# Altium project STM32_F4VX_M.PrjPcb
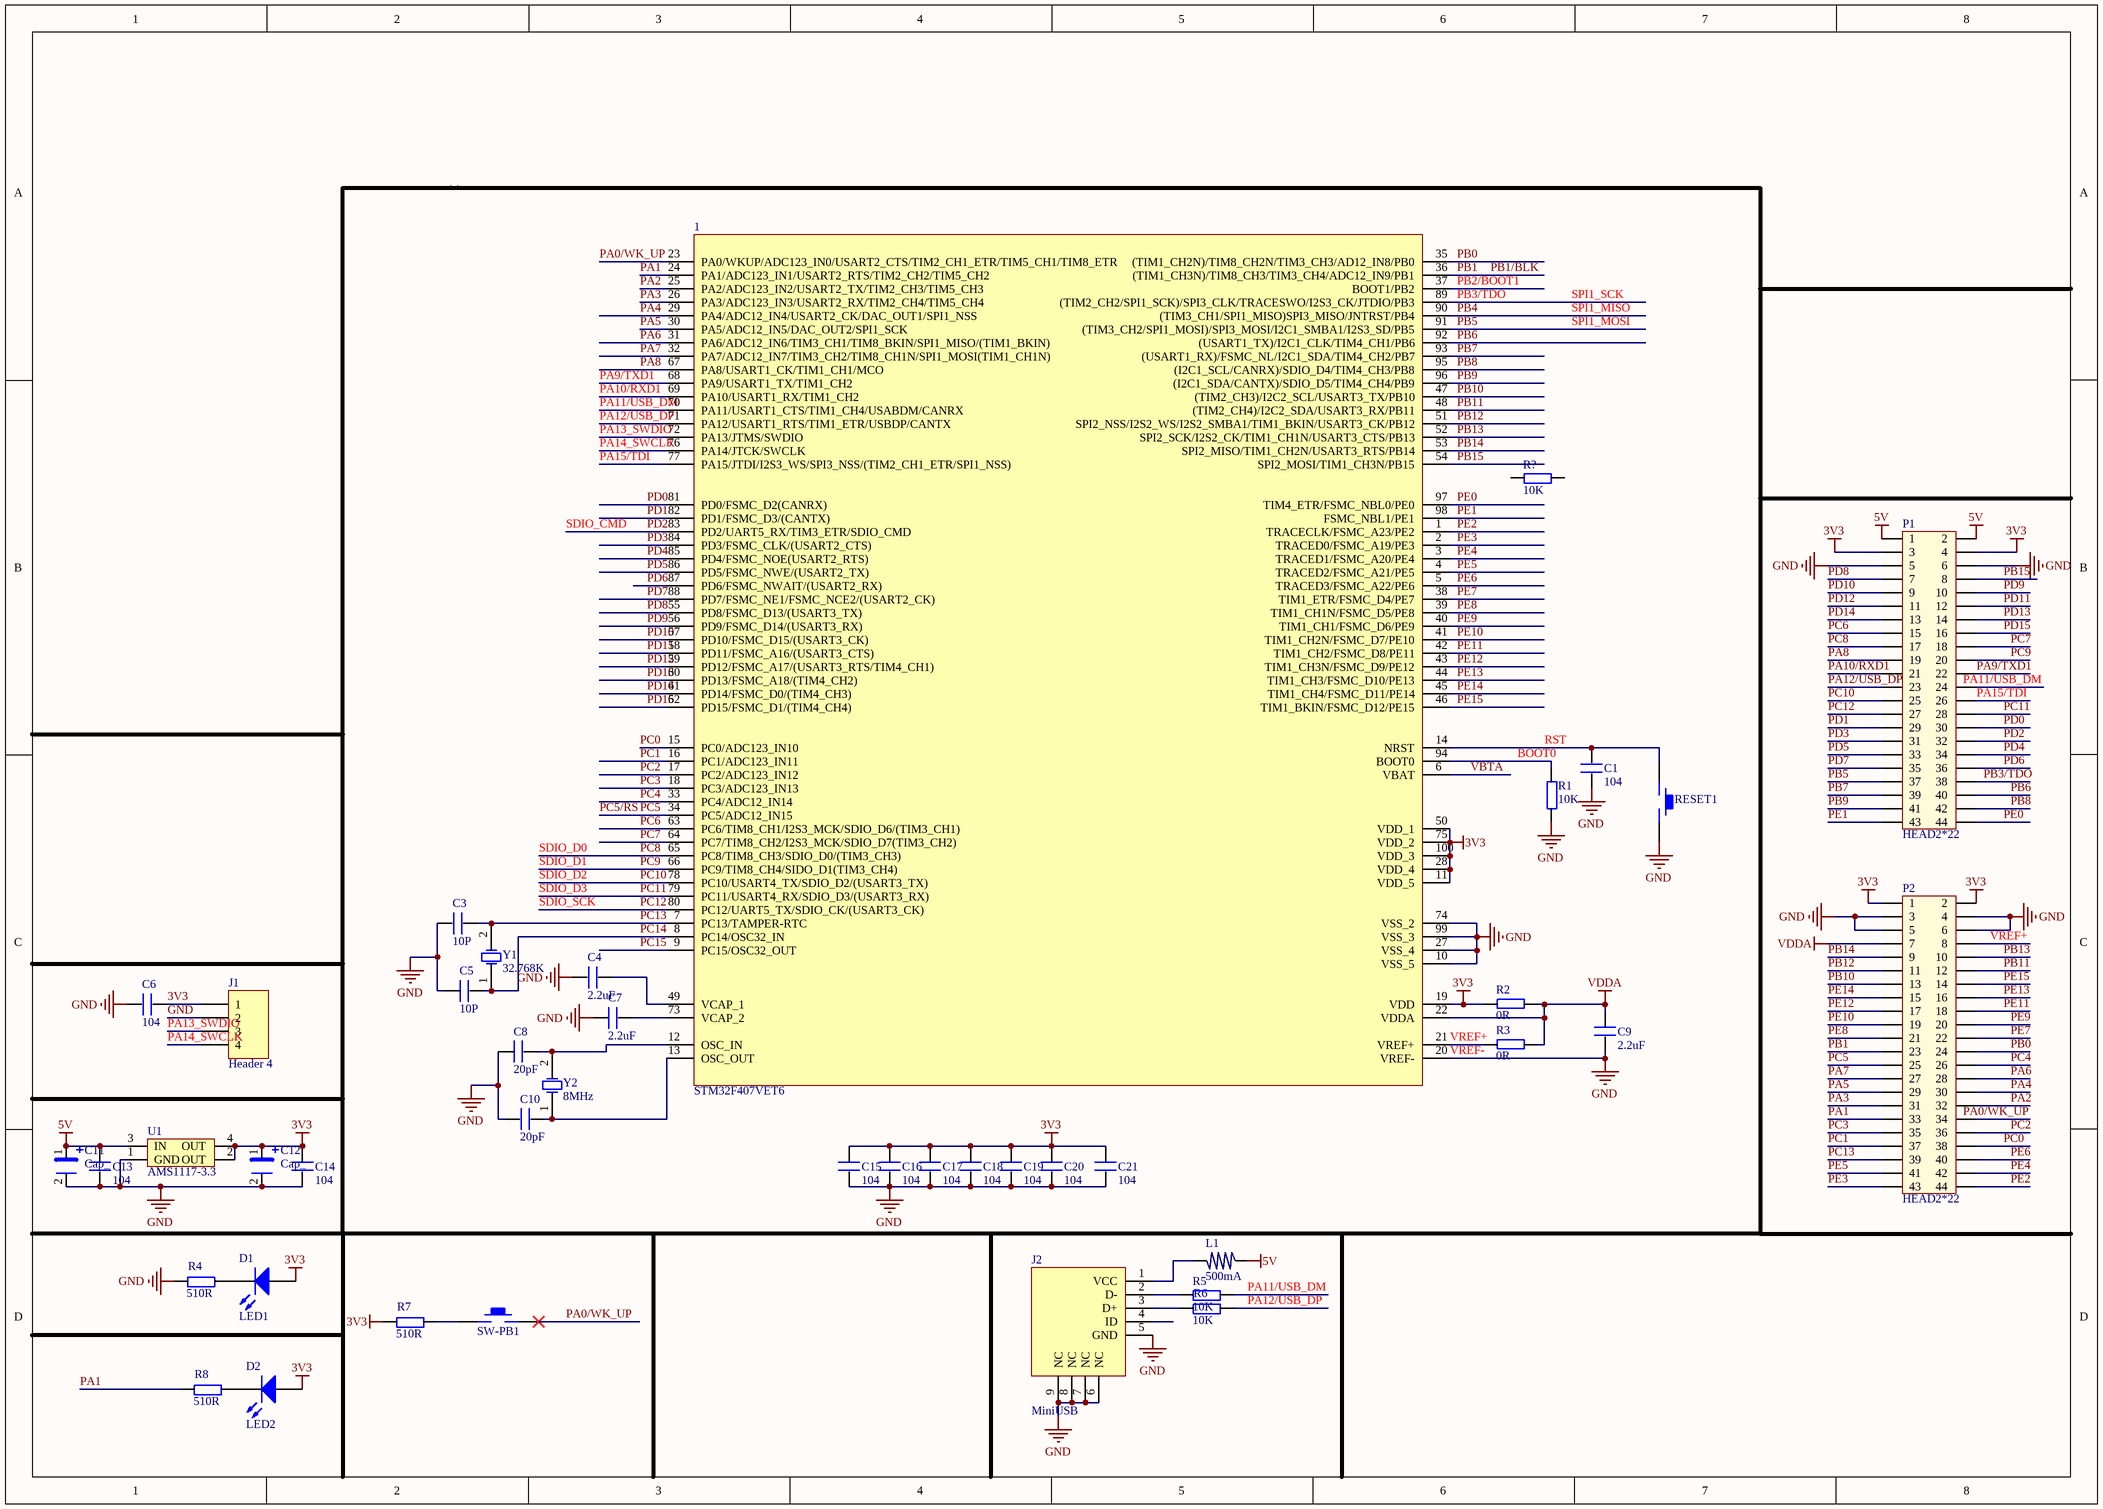
[diagram p0: STM32_F4VX_M.SchDoc]
1 sheet, 42 parts. Net scope: global (net labels, ports and power ports of the same name join across sheets).
Board file: STM32F4_.PcbDoc

## Sheet STM32_F4VX_M.SchDoc
size A3

### Parts
1  STM32F407VET6  [STM-LQFP100_V]
C1  104  [0603P]
C3  10P  [0603P]
C4  2.2uF  [0603P]
C5  10P  [0603P]
C6  104  [0603P]
C7  2.2uF  [0603P]
C8  20pF  [0603P]
C9  2.2uF  [0603P]
C10  20pF  [0603P]
C11  Cap_  [RC0805]
C12  Cap_  [RC0805]
C13  104  [0603P]
C14  104  [0603P]
C15  104  [0603P]
C16  104  [0603P]
C17  104  [0603P]
C18  104  [0603P]
C19  104  [0603P]
C20  104  [0603P]
C21  104  [0603P]
D1  LED1  [SMDLED]
D2  LED2  [SMDLED]
J1  Header 4  [HDR1X4]
J2  MiniUSB  [micro_USB]
L1  500mA  [0603P]
P1  HEAD2*22  [HEAD2*22]
P2  HEAD2*22  [HEAD2*22]
R1  10K  [0603P]
R2  0R  [0603P]
R3  0R  [0603P]
R4  510R  [0603P]
R5  10K  [0603P]
R6  10K  [0603P]
R7  510R  [0603P]
R8  510R  [0603P]
R?  10K  [0603P]
RESET1  KEY_M  [SW-SPST]  (value not drawn)
SW-PB1  KEY_M  [SW-SPST]  (value not drawn)
U1  AMS1117-3.3  [AMS1117]
Y1  32.768K  [JZ3215-32K]
Y2  8MHz  [JZ5032-8M]

### Nets
3V3: 1.11(VDD_5) 1.19(VDD) 1.28(VDD_4) 1.50(VDD_1) 1.75(VDD_2) 1.100(VDD_3) C6.1 C12.1 C14.2 C15.2 C16.2 C17.2 C18.2 C19.2 C20.2 C21.2 D1.1(A) D2.1(A) J1.1 P1.3 P1.4 P2.1 P2.2 R2.2 R7.1 U1.2(OUT) U1.4(OUT)
5V: C11.1 C13.2 L1.1 P1.1 P1.2 U1.3(IN)
GND: 1.10(VSS_5) 1.20(VREF-) 1.27(VSS_4) 1.74(VSS_2) 1.99(VSS_3) C1.1 C3.1 C4.1 C5.1 C6.2 C7.1 C8.1 C9.1 C10.1 C11.2 C12.2 C13.1 C14.1 C15.1 C16.1 C17.1 C18.1 C19.1 C20.1 C21.1 J1.2 J2.5(GND) J2.6(NC) J2.7(NC) J2.8(NC) J2.9(NC) P1.5 P1.6 P2.3 P2.4 P2.5 P2.6 R1.1 R4.1 RESET1.2 U1.1(GND)  [also labelled VREF-]
VDDA: 1.22(VDDA) C9.2 P2.7 R2.1 R3.1
BOOT0: 1.94(BOOT0) R1.2
PA0/WK_UP: 1.23(PA0/WKUP/ADC123_IN0/USART2_CTS/TIM2_CH1_ETR/TIM5_CH1/TIM8_ETR) SW-PB1.2
PA1: 1.24(PA1/ADC123_IN1/USART2_RTS/TIM2_CH2/TIM5_CH2) P2.33 R8.1
PA2: 1.25(PA2/ADC123_IN2/USART2_TX/TIM2_CH3/TIM5_CH3) P2.32
PA3: 1.26(PA3/ADC123_IN3/USART2_RX/TIM2_CH4/TIM5_CH4) P2.31
PA4: 1.29(PA4/ADC12_IN4/USART2_CK/DAC_OUT1/SPI1_NSS) P2.30
PA5: 1.30(PA5/ADC12_IN5/DAC_OUT2/SPI1_SCK) P2.29
PA6: 1.31(PA6/ADC12_IN6/TIM3_CH1/TIM8_BKIN/SPI1_MISO/(TIM1_BKIN)) P2.28
PA7: 1.32(PA7/ADC12_IN7/TIM3_CH2/TIM8_CH1N/SPI1_MOSI(TIM1_CH1N)) P2.27
PA8: 1.67(PA8/USART1_CK/TIM1_CH1/MCO) P1.19
PA9/TXD1: 1.68(PA9/USART1_TX/TIM1_CH2) P1.22
PA10/RXD1: 1.69(PA10/USART1_RX/TIM1_CH2) P1.21
PA11/USB_DM: 1.70(PA11/USART1_CTS/TIM1_CH4/USABDM/CANRX) R5.2
PA12/USB_DP: 1.71(PA12/USART1_RTS/TIM1_ETR/USBDP/CANTX) P1.23 R6.2
PA13_SWDIO: 1.72(PA13/JTMS/SWDIO) J1.3
PA14_SWCLK: 1.76(PA14/JTCK/SWCLK) J1.4
PA15/TDI: 1.77(PA15/JTDI/I2S3_WS/SPI3_NSS/(TIM2_CH1_ETR/SPI1_NSS)) P1.26
PB0: 1.35((TIM1_CH2N)/TIM8_CH2N/TIM3_CH3/AD12_IN8/PB0) P2.24
PB1: 1.36((TIM1_CH3N)/TIM8_CH3/TIM3_CH4/ADC12_IN9/PB1) P2.23  [also labelled PB1/BLK]
PB2/BOOT1: 1.37(BOOT1/PB2)
PB3/TDO: 1.89((TIM2_CH2/SPI1_SCK)/SPI3_CLK/TRACESWO/I2S3_CK/JTDIO/PB3) P1.38  [also labelled SPI1_SCK]
PB4: 1.90((TIM3_CH1/SPI1_MISO)SPI3_MISO/JNTRST/PB4)  [also labelled SPI1_MISO]
PB5: 1.91((TIM3_CH2/SPI1_MOSI)/SPI3_MOSI/I2C1_SMBA1/I2S3_SD/PB5) P1.37  [also labelled SPI1_MOSI]
PB6: 1.92((USART1_TX)/I2C1_CLK/TIM4_CH1/PB6) P1.40
PB7: 1.93((USART1_RX)/FSMC_NL/I2C1_SDA/TIM4_CH2/PB7) P1.39
PB8: 1.95((I2C1_SCL/CANRX)/SDIO_D4/TIM4_CH3/PB8) P1.42
PB9: 1.96((I2C1_SDA/CANTX)/SDIO_D5/TIM4_CH4/PB9) P1.41
PB10: 1.47((TIM2_CH3)/I2C2_SCL/USART3_TX/PB10) P2.13
PB11: 1.48((TIM2_CH4)/I2C2_SDA/USART3_RX/PB11) P2.12
PB12: 1.51(SPI2_NSS/I2S2_WS/I2S2_SMBA1/TIM1_BKIN/USART3_CK/PB12) P2.11
PB13: 1.52(SPI2_SCK/I2S2_CK/TIM1_CH1N/USART3_CTS/PB13) P2.10
PB14: 1.53(SPI2_MISO/TIM1_CH2N/USART3_RTS/PB14) P2.9
PB15: 1.54(SPI2_MOSI/TIM1_CH3N/PB15) P1.8
PC0: 1.15(PC0/ADC123_IN10) P2.38
PC1: 1.16(PC1/ADC123_IN11) P2.37
PC2: 1.17(PC2/ADC123_IN12) P2.36
PC3: 1.18(PC3/ADC123_IN13) P2.35
PC4: 1.33(PC4/ADC12_IN14) P2.26
PC5: 1.34(PC5/ADC12_IN15) P2.25  [also labelled PC5/RS]
PC6: 1.63(PC6/TIM8_CH1/I2S3_MCK/SDIO_D6/(TIM3_CH1)) P1.15
PC7: 1.64(PC7/TIM8_CH2/I2S3_MCK/SDIO_D7(TIM3_CH2)) P1.18
PC8: 1.65(PC8/TIM8_CH3/SDIO_D0/(TIM3_CH3)) P1.17  [also labelled SDIO_D0]
PC9: 1.66(PC9/TIM8_CH4/SIDO_D1(TIM3_CH4)) P1.20  [also labelled SDIO_D1]
PC10: 1.78(PC10/USART4_TX/SDIO_D2/(USART3_TX)) P1.25  [also labelled SDIO_D2]
PC11: 1.79(PC11/USART4_RX/SDIO_D3/(USART3_RX)) P1.28  [also labelled SDIO_D3]
PC12: 1.80(PC12/UART5_TX/SDIO_CK/(USART3_CK)) P1.27  [also labelled SDIO_SCK]
PC13: 1.7(PC13/TAMPER-RTC) C3.2 P2.39 Y1.2(OSC2)
PC14: 1.8(PC14/OSC32_IN) C5.2 Y1.1(OSC1)
PC15: 1.9(PC15/OSC32_OUT)
PD0: 1.81(PD0/FSMC_D2(CANRX)) P1.30
PD1: 1.82(PD1/FSMC_D3/(CANTX)) P1.29
PD2: 1.83(PD2/UART5_RX/TIM3_ETR/SDIO_CMD) P1.32  [also labelled SDIO_CMD]
PD3: 1.84(PD3/FSMC_CLK/(USART2_CTS)) P1.31
PD4: 1.85(PD4/FSMC_NOE(USART2_RTS)) P1.34
PD5: 1.86(PD5/FSMC_NWE/(USART2_TX)) P1.33
PD6: 1.87(PD6/FSMC_NWAIT/(USART2_RX)) P1.36
PD7: 1.88(PD7/FSMC_NE1/FSMC_NCE2/(USART2_CK)) P1.35
PD8: 1.55(PD8/FSMC_D13/(USART3_TX)) P1.7
PD9: 1.56(PD9/FSMC_D14/(USART3_RX)) P1.10
PD10: 1.57(PD10/FSMC_D15/(USART3_CK)) P1.9
PD11: 1.58(PD11/FSMC_A16/(USART3_CTS)) P1.12
PD12: 1.59(PD12/FSMC_A17/(USART3_RTS/TIM4_CH1)) P1.11
PD13: 1.60(PD13/FSMC_A18/(TIM4_CH2)) P1.14
PD14: 1.61(PD14/FSMC_D0/(TIM4_CH3)) P1.13
PD15: 1.62(PD15/FSMC_D1/(TIM4_CH4)) P1.16
PE0: 1.97(TIM4_ETR/FSMC_NBL0/PE0) P1.44
PE1: 1.98(FSMC_NBL1/PE1) P1.43
PE2: 1.1(TRACECLK/FSMC_A23/PE2) P2.44
PE3: 1.2(TRACED0/FSMC_A19/PE3) P2.43
PE4: 1.3(TRACED1/FSMC_A20/PE4) P2.42
PE5: 1.4(TRACED2/FSMC_A21/PE5) P2.41
PE6: 1.5(TRACED3/FSMC_A22/PE6) P2.40
PE7: 1.38(TIM1_ETR/FSMC_D4/PE7) P2.22
PE8: 1.39(TIM1_CH1N/FSMC_D5/PE8) P2.21
PE9: 1.40(TIM1_CH1/FSMC_D6/PE9) P2.20
PE10: 1.41(TIM1_CH2N/FSMC_D7/PE10) P2.19
PE11: 1.42(TIM1_CH2/FSMC_D8/PE11) P2.18
PE12: 1.43(TIM1_CH3N/FSMC_D9/PE12) P2.17
PE13: 1.44(TIM1_CH3/FSMC_D10/PE13) P2.16
PE14: 1.45(TIM1_CH4/FSMC_D11/PE14) P2.15
PE15: 1.46(TIM1_BKIN/FSMC_D12/PE15) P2.14
RST: 1.14(NRST) C1.2 RESET1.1
VBTA: 1.6(VBAT)
VREF+: 1.21(VREF+) P2.8 R3.2
Net1_12: 1.12(OSC_IN) C8.2 Y2.2(OSC2)
Net1_13: 1.13(OSC_OUT) C10.2 Y2.1(OSC1)
Net1_49: 1.49(VCAP_1) C4.2
Net1_73: 1.73(VCAP_2) C7.2
NetD1_2: D1.2(K) R4.2
NetD2_2: D2.2(K) R8.2
NetJ2_1: J2.1(VCC) L1.2
NetJ2_2: J2.2(D-) R5.1
NetJ2_3: J2.3(D+) R6.1
NetR7_2: R7.2 SW-PB1.1

Not connected (* = marked no-connect by the designer): J2 4(ID); P1 24; P2 34; R? 1 2

### Notes on the sheet
- Labels drawn without touching a wire or pin: PA0/WK_UP, PA11/USB_DM

### Library data of the parts
C1 C3-C10 C13-C21 = C
D1 D2 = LED2: Typical RED, GREEN, YELLOW, AMBER GaAs LED; Published: 8-Jun-2000; LatestRevisionDate: 17-Jul-2002; LatestRevisionNote: Re-released for DXP Platform.; PackageDocument: Feb-2002; PackageReference: 3.2X1.6X1.1; Publisher: Altium Limited
J1 = Header 4: Header, 4-Pin; LatestRevisionDate: 17-Jul-2002; LatestRevisionNote: Re-released for DXP Platform.; Publisher: Altium Limited
L1 = L
R1-R8 R? = R
U1 = AMS1117
Y1 Y2 = XTAL: Crystal Oscillator; Published: 8-Jun-2000; LatestRevisionDate: 17-Jul-2002; LatestRevisionNote: Re-released for DXP Platform.; Publisher: Altium Limited